# Altium schematic sheet power.SchDoc
size A
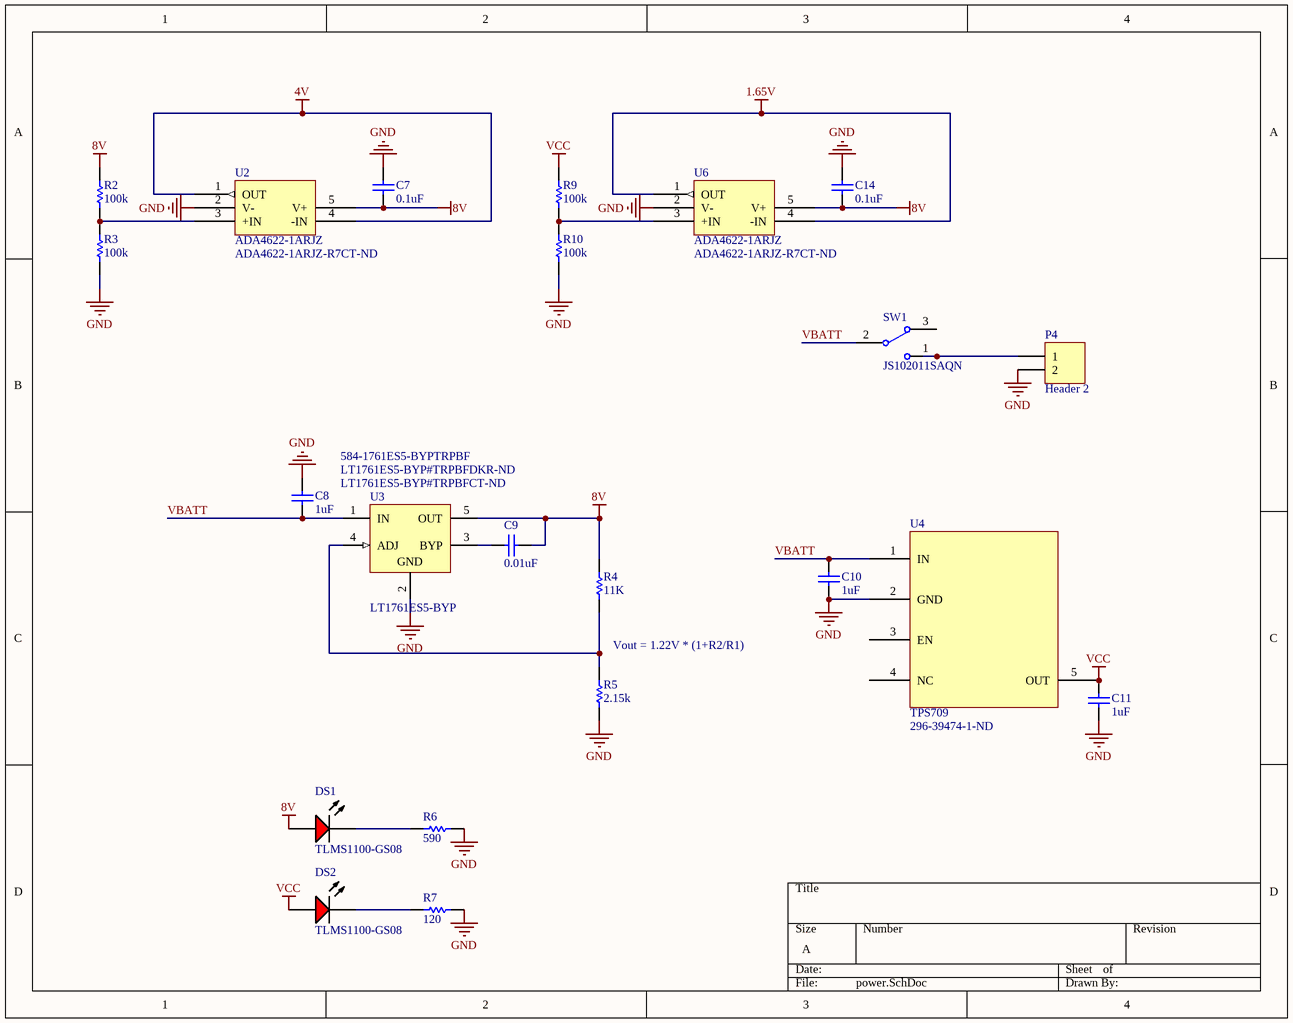
[diagram p0: power.SchDoc]

## Parts
C7  value 0.1uF  [0603]  (hidden comment: Cap)
C8  value 1uF  [0603]  (hidden comment: Cap)
C9  value 0.01uF  [0603]  (hidden comment: Cap)
C10  value 1uF  [0603]  (hidden comment: Cap)
C11  value 1uF  [0603]  (hidden comment: Cap)
C14  value 0.1uF  [0603]  (hidden comment: Cap)
DS1  TLMS1100-GS08  [VISH-TLMX1100_V]
DS2  TLMS1100-GS08  [VISH-TLMX1100_V]
P4  Header 2  [HDR1X2]
R2  value 100k  [0603]  (hidden comment: Res)
R3  value 100k  [0603]  (hidden comment: Res)
R4  value 11K  [0603]  (hidden comment: Res)
R5  value 2.15k  [0603]  (hidden comment: Res)
R6  value 590  [0603]  (hidden comment: Res)
R7  value 120  [0603]  (hidden comment: Res)
R9  value 100k  [0603]  (hidden comment: Res)
R10  value 100k  [0603]  (hidden comment: Res)
SW1  JS102011SAQN  [CKCP-JS102011SAQN-3_V]
U2  ADA4622-1ARJZ  Supplier Part Number 1: ADA4622-1ARJZ-R7CT-ND  [SOT95P280X145-5N]
U3  LT1761ES5-BYP  Supplier Part Number 1: LT1761ES5-BYP#TRPBFCT-ND  Supplier Part Number 2: LT1761ES5-BYP#TRPBFDKR-ND  Supplier Part Number 3: 584-1761ES5-BYPTRPBF  [LT-S5-5-TSOT-23_N]
U4  TPS709  Supplier Part Number 1: 296-39474-1-ND  [SOT95P280X145-5N]
U6  ADA4622-1ARJZ  Supplier Part Number 1: ADA4622-1ARJZ-R7CT-ND  [SOT95P280X145-5N]

## Nets
1.65V: U6.1(OUT) U6.4(-IN)
4V: U2.1(OUT) U2.4(-IN)
8V: C7.1 C9.1 C14.1 DS1.1(A) R2.2 R4.2 U2.5(V+) U3.5(OUT) U6.5(V+)
GND: C7.2 C8.2 C10.2 C11.2 C14.2 P4.2 R3.1 R5.1 R6.1 R7.1 R10.1 U2.2(V-) U3.2(GND) U4.2(GND) U6.2(V-)
VCC: C11.1 DS2.1(A) R9.2 U4.5(OUT)
VBATT: C8.1 C10.1 SW1.2 U3.1(IN) U4.1(IN)
NetC9_2: C9.2 U3.3(BYP)
NetDS1_2: DS1.2(K) R6.2
NetDS2_2: DS2.2(K) R7.2
NetP4_1: P4.1 SW1.1
NetR2_1: R2.1 R3.2 U2.3(+IN)
NetR4_1: R4.1 R5.2 U3.4(ADJ)
NetR9_1: R9.1 R10.2 U6.3(+IN)

Not connected (* = marked no-connect by the designer): SW1 3; U4 3(EN) 4(NC)

## Notes on the sheet
- Vout = 1.22V * (1+R2/R1)

## Library data of the parts
C7-C11 C14 = Cap: Ceramic Capacitor (Surface Mount); Manufacturer: Generic Ceramic Chip Cap (TBD); Digi-Key Part Number: *; Manufacturer Part Number: *; Note: *; Rating: *
DS1 DS2 = CMP-1666-00027-1: LED, RED, 2.1 V, -40 to 100 degC, 2-Pin SMD (0603), RoHS, Tape and Reel; Type (Capacitors): C0G; Resistance: 100000000000 Ohm; Capacitance: 12 pF; Voltage Rating: 50 V; Tolerance: 5%; Min Operating Temperature: -55degC; REACH SVHC: No SVHC; ComponentLink2Description: Datasheet; ComponentLink1URL: http://www.vishay.com/; Width: 0.8 mm; Package Quantity: 4000; PackageReference: TLMX1100; ComponentLink2URL: http://www.vishay.com/docs/83173/tlmb1100.pdf; Case/Package: 0603; Case Code (Metric): 1608; Packaging: Tape and Reel; Pins: 2; ComponentLink1Description: Manufacturer URL; Max Operating Temperature: 125degC; Height: 0.8 mm; Length: 1.6 mm; Mount: Surface Mount; PackageDescription: 2-Pin Surface Mount Device, Body 1.6 x 0.8 mm; DatasheetVersion: Rev. 2.7, 03/2016; Case Code (Imperial): 0603; Voltage Rating (DC): 50 V; RoHSCompliant: True; Radiation Hardening: No
P4 = Header 2: Header, 2-Pin; LatestRevisionDate: 17-Jul-2002; LatestRevisionNote: Re-released for DXP Platform.; Publisher: Altium Limited
R2-R7 R9 R10 = Res: Chip Resistor (Surface Mount); Manufacturer: Generic Chip Res (TBD); Manufacturer Part Number: *; Digi-Key Part Number: *; Rating: *
SW1 = CMP-2000-06501-1: Sub-Miniature Slide Switch, SPDT, -40 to 85 degC, 3-Pin SMD, RoHS, Tape and Reel; Manufacturer: C&K Components; Electrical Life: 15000Cycles; Actuator Color: Black; Body Orientation: RightAngle; Minimum Insulation Resistance: 100MOhm; Contact Rating @ Voltage: 0.3@6VDCA; Actuator Style: SideSlide; Maximum DC Voltage Rating: 6V; COO: US; Actuator Material: Nylon4/6; Dielectric Strength: 500VAC; Maximum Contact Resistance: 70mOhm; Base Material: N/A; Mounting Technology: SurfaceMount; Switch Configuration: N/A; Package Reference: SMT; Package Description: 3-Pin Surface Mount Device, Body 9 x 3.6 mm, Height 3.5 mm; Mounting: SurfaceMount,GullWing; Part No: JS102011SAQN; Dimension: 9x4.3mm; Type: Sub-Miniature; Product Weight: N/A; Seal Location: N/A; Family: JS; ECCN: EAR99; Supplier: C&KComponents; Seal Description: N/A; Contact Plating: Silver; Pole Throw Configuration: SPDT; Packaging: TapeandReel; Manufacturer URL: http://www.ckswitches.com/; Datasheet URL: https://datasheet.ciiva.com/1532/js-9dec14-1532400.pdf; Maximum AC Voltage Rating: N/A; Mechanical Life: N/A; HTS: 8536509050; Datasheet Version: 12/2014; Housing Material: Nylon4/6; Contact Material: CopperAlloy; RoHS: Yes; Operating Temperature: -40to85C
U2 U6 = ADA4622-1ARJZ: 30 V, 8 MHz, Low Bias Current, / Single-Supply, RRO, Precision Op Amps; ComponentLink1Description: Datasheet; ComponentLink1URL: http://www.analog.com/media/en/technical-documentation/data-sheets/ada4622-1-4622-2-4622-4.pdf; Supplier 1: Digi-Key
U3 = CMP-0476-01245-1: 100 mA, Low Noise, LDO Micropower Regulator, 1.8 to 20 V Vin, Adjustable Vout, 5-pin SOT23 (S5-5), -40 to 125 degC; Manufacturer: Linear Technology; Vout Max(V): 20; Isupply(mA): 0.02; PSRR(dB): 65; Vout Min(V): 1.22; Iout(mA): 100; Shutdown Current(uA): 1; Discrete Pass Element: no; Vin Min(V): 1.8; Output Voltage: Adj; Dropout Voltage(V): 0.3; PackageDescription: 5-Pin Plastic TSOT-23, Body 1.63 x 2.90 mm, Pitch 0.95 mm; ComponentLink2URL: http://cds.linear.com/docs/en/datasheet/1761sff.pdf; Code_JEDEC: MO-193; DatasheetVersion: Rev. F; Mounting Technology: Surface Mount; PackageReference: S5-5; ComponentLink3Description: Package Specification; ComponentLink2Description: Datasheet; ComponentLink1Description: Manufacturer URL; RoHS: FALSE; Number of Outputs: 1; Noise(uV): 20; Vin Max(V): 20; ComponentLink1URL: http://www.linear.com/; PackageVersion: Jun-10; ComponentLink3URL: http://cds.linear.com/docs/en/packaging/SOT_5_05-08-1635.pdf; PartNumber: LT1761ES5-BYP; Supplier 1: Digi-Key; Supplier 2: Digi-Key; Supplier 3: Mouser
U4 = TPS70933: 3.3V Ultra low power Voltage Regulator; Supplier 1: Digi-Key